# EAGLE design akcel_onlyboard (EAGLE 7.7.0)
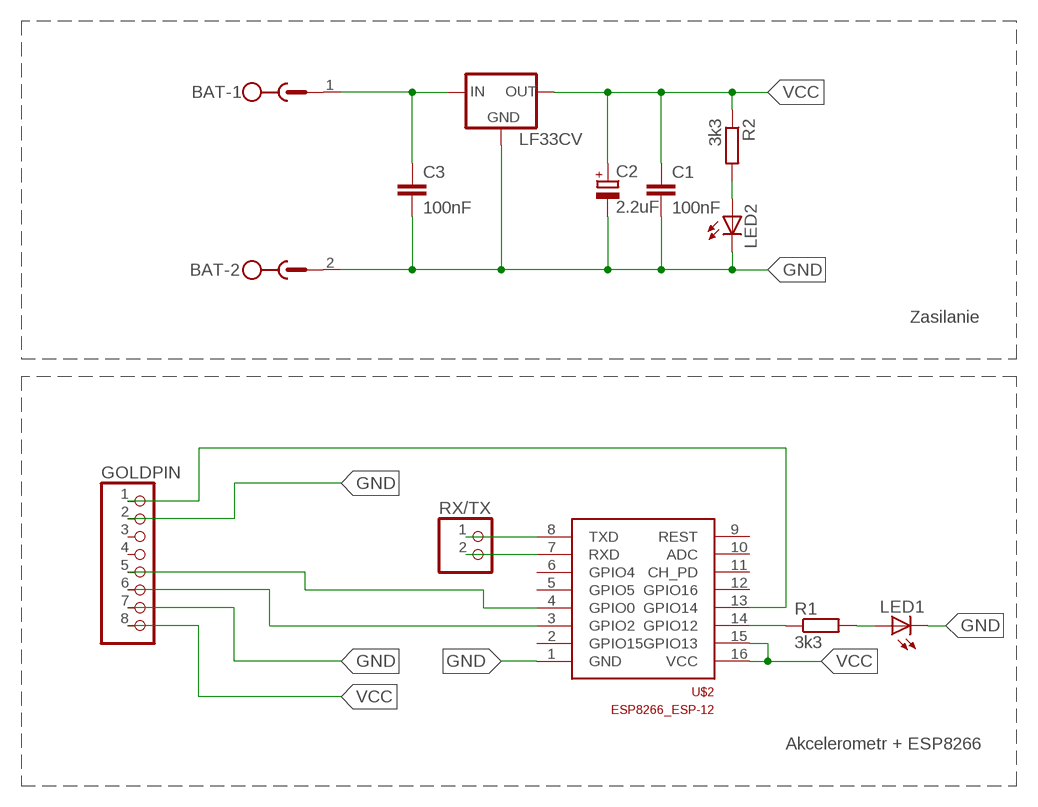
[diagram p0: schematic, sheet 1]

## Parts
BAT  MSTBV2  [MSTBV2]
C1  100nF  C-EUC0805K  [C0805K]
C2  2.2uF  CPOL-EU153CLV-0405  [153CLV-0405]
C3  100nF  C-EUC0805K  [C0805K]
GOLDPIN  PINHD-1X8  [1X08]
LED1  LED3MM  [LED3MM]
LED2  LED3MM  [LED3MM]
LF33CV  LM1117TO252  [TO252]
R1  3k3  R-EU_M0805  [M0805]
R2  3k3  R-EU_M0805  [M0805]
RX/TX  PINHD-1X2  [1X02]
U$2  ESP8266_ESP-12  [ESP8266-ESP12]

## Nets
GND: BAT.2 C1.2 C2.- C3.2 GOLDPIN.2 GOLDPIN.7 LED1.K(C) LED2.K(C) LF33CV.3(GND) U$2.1(GND)
N$1: GOLDPIN.6 U$2.3(GPIO2)
N$2: GOLDPIN.5 U$2.4(GPIO0)
N$4: GOLDPIN.1 U$2.13(GPIO14)
N$5: RX/TX.1 U$2.8(TXD)
N$6: RX/TX.2 U$2.7(RXD)
N$7: R1.1 U$2.14(GPIO12)
N$8: LED1.A R1.2
N$9: BAT.1 C3.1 LF33CV.1(IN)
N$11: LED2.A R2.2
VCC: C1.1 C2.+ GOLDPIN.8 LF33CV.2(OUT) R2.1 U$2.15(GPIO13) U$2.16(VCC)
Unconnected: GOLDPIN.3 GOLDPIN.4 U$2.2(GPIO15) U$2.5(GPIO5) U$2.6(GPIO4) U$2.9(REST) U$2.10(ADC) U$2.11(CH_PD) U$2.12(GPIO16)

## Notes on the sheet
- Zasilanie
- Akcelerometr + ESP8266

## Library data of the parts
BAT = con-phoenix-500:MSTBV2: PHOENIX; OC_FARNELL: unknown; OC_NEWARK: unknown
C1 C3 = rcl:C-EU: CAPACITOR, European symbol
C2 = rcl:CPOL-EU: POLARIZED CAPACITOR, European symbol
GOLDPIN = pinhead:PINHD-1X8: PIN HEADER
LED1 LED2 = led:LED: LED OSRAM: - CHIPLED LG R971, LG N971, LY N971, LG Q971, LY Q971, LO R971, LY R971 LH N974, LH R974 LS Q976, LO Q976, LY Q976 LO Q996 - Hyper CHIPLED LW Q18S LB Q993, LB Q99A, LB R99A - SideLED LS A670, LO A670, LY A670, LG A670, LP A670 LB A673, LV A673, LT A673, LW A673 LH A674 LY A675 LS A676, LA A676, LO A676, LY A676, LW A676 LS A679, LY A679, LG A679 - Hyper Micro SIDELED® LS Y876, LA Y876, LO Y876, LY Y876 LT Y87S - SmartLED LW L88C, LW L88S LB L89C, LB L89S, LG L890 LS L89K, LO L89K, LY L89K LS L896, LA L896, LO L896, LY L896 - TOPLED LS T670, LO T670, LY T670, LG T670, LP T670 LSG T670, LSP T670, LSY T670, LOP T670, LYG T670 LG T671, LOG T671, LSG T671 LB T673, LV T673, LT T673, LW T673 LH T674 LS T676, LA T676, LO T676, LY T676, LB T676, LH T676, LSB T676, LW T676 LB T67C, LV T67C, LT T67C, LS T67K, LO T67K, LY T67K, LW E67C LS E67B, LA E67B, LO E67B, LY E67B, LB E67C, LV E67C, LT E67C LW T67C LS T679, LY T679, LG T679 LS T770, LO T770, LY T770, LG T770, LP T770 LB T773, LV T773, LT T773, LW T773 LH T774 LS E675, LA E675, LY E675, LS T675 LS T776, LA T776, LO T776, LY T776, LB T776 LHGB T686 LT T68C, LB T68C - Hyper Mini TOPLED® LB M676 - Mini TOPLED Santana® LG M470 LS M47K, LO M47K, LY M47K Source: http://www.osram.convergy.de LUXEON: - LUMILED® LXK2-PW12-R00, LXK2-PW12-S00, LXK2-PW14-U00, LXK2-PW14-V00 LXK2-PM12-R00, LXK2-PM12-S00, LXK2-PM14-U00 LXK2-PE12-Q00, LXK2-PE12-R00, LXK2-PE12-S00, LXK2-PE14-T00, LXK2-PE14-U00 LXK2-PB12-K00, LXK2-PB12-L00, LXK2-PB12-M00, LXK2-PB14-N00, LXK2-PB14-P00, LXK2-PB14-Q00 LXK2-PR12-L00, LXK2-PR12-M00, LXK2-PR14-Q00, LXK2-PR14-R00 LXK2-PD12-Q00, LXK2-PD12-R00, LXK2-PD12-S00 LXK2-PH12-R00, LXK2-PH12-S00 LXK2-PL12-P00, LXK2-PL12-Q00, LXK2-PL12-R00 Source: www.luxeon.com KINGBRIGHT: KA-3528ASYC Source: www.kingbright.com
LF33CV = v-reg-3:LM1117
R1 R2 = rcl:R-EU_: RESISTOR, European symbol
RX/TX = pinhead:PINHD-1X2: PIN HEADER
U$2 = esp8266-12:ESP8266_ESP-12

## Board
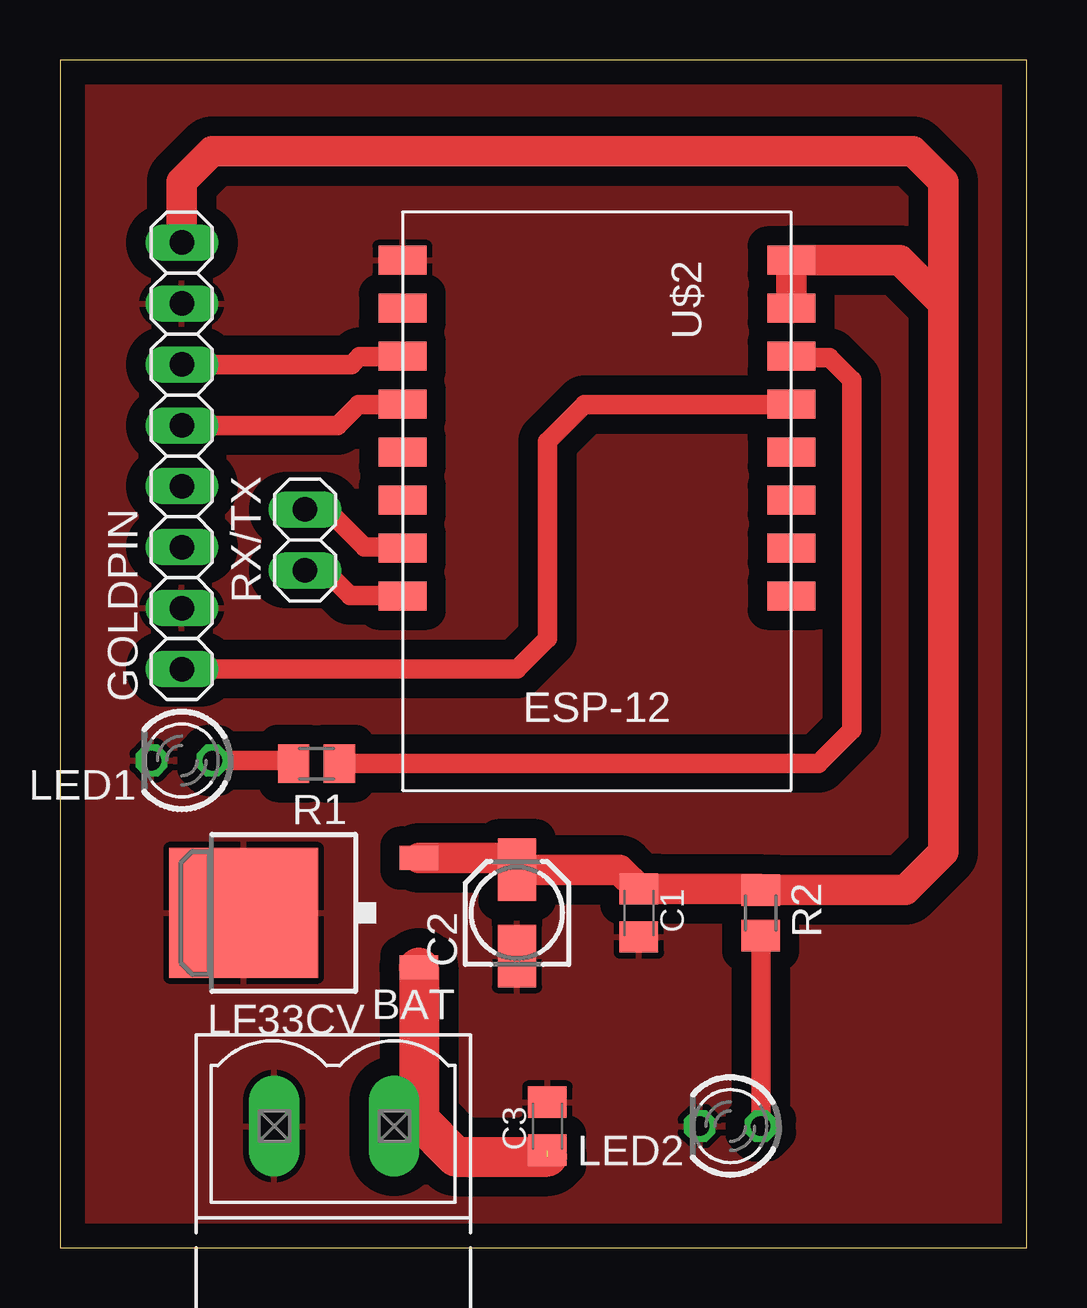
[diagram p1: board, top side]

Size 40.31 x 49.52 mm. Coordinates in mm from the lower left corner, seen from the top.
Outline: 0,0 40.31,0 40.31,49.52 0,49.52 0,0
Copper layers (1*16): Top 0.035mm / dielectric 1.5mm / Bottom 0.035mm
Design rules "default": minimum track width 10mil, minimum drill 24mil, track to track 8mil, track to pad 8mil, pad to pad 8mil, via to via 8mil, smd to smd 8mil, copper to edge 40mil, drill to drill 8mil, minimum pad ring 10mil, minimum via ring 8mil, stop-mask expansion 4mil, vias tented up to drill 0mil, thermal gap 10mil

### Footprints (pad centres in the part's own frame; a part is rotated, then mirrored left to right if it is on the bottom)
MSTBV2 = drill 1.397 long: 1 -2.5,0; 2 2.5,0
C0805K = smd 1.3 x 1.6: 1 -1,0; 2 1,0
153CLV-0405 = smd 2.6 x 1.6: + 1.8,0; - -1.8,0
1X08 = drill 1.016 long: 1 -8.89,0; 2 -6.35,0; 3 -3.81,0; 4 -1.27,0; 5 1.27,0; 6 3.81,0; 7 6.35,0; 8 8.89,0
LED3MM = drill 0.813 octagon: A -1.27,0; K 1.27,0
TO252 = smd 1 x 1.6: 1 -2.28,-6.07; 2 2.28,-6.07 | smd 5.4 x 6.2: 3 0,1.23
M0805 = smd 1.3 x 1.6: 1 -0.95,0; 2 0.95,0
1X02 = drill 1.016 long: 1 -1.27,0; 2 1.27,0
ESP8266-ESP12 = smd 2 x 1.2: 1 16.2,2; 2 16.2,4; 3 16.2,6; 4 16.2,8; 5 16.2,10; 6 16.2,12; 7 16.2,14; 8 16.2,16; 9 0,16; 10 0,14; 11 0,12; 12 0,10; 13 0,8; 14 0,6; 15 0,4; 16 0,2

### Placement (x,y rotation side)
BAT  11.43,5.08 180 top
C1  24.13,13.97 270 top
C2  19.05,13.97 90 top
C3  20.32,5.08 90 top
GOLDPIN  5.08,33.02 90 top
LED1  5.08,20.32 180 top
LED2  27.94,5.08 180 top
LF33CV  8.89,13.97 90 top
R1  10.69,20.19 180 top
R2  29.21,13.97 270 top
RX/TX  10.21,29.51 90 top
U$2  30.48,43.18 180 top

### Tracks (layer width: path | path; a pad name or v marks a point on that pad's centre or on a via)
GND
  pour Top (isolate 0.813): 0,49.53 40.64,49.53 40.64,0 0,0
N$1
  Top 0.813: GOLDPIN.6 12.17,36.83 12.5,37.16 14.26,37.16 U$2.3
N$2
  Top 0.813: GOLDPIN.5 11.58,34.29 12.45,35.15 14.25,35.15 U$2.4
N$4
  Top 0.813: U$2.13 30.45,35.15 21.87,35.15 20.32,33.6 20.32,25.4 19.05,24.13 GOLDPIN.1
N$5
  Top 0.813: 14.18,27.08 U$2.8 14.26,27.2 12.09,27.2 11.05,28.25 RX/TX.1
N$6
  Top 0.813: 14.26,29.16 U$2.7 14.25,29.21 12.7,29.21 11.12,30.79 RX/TX.2
N$7
  Top 0.813: R1.1 31.62,20.19 33.02,21.59 33.02,36.17 32.08,37.11 30.55,37.11 U$2.14
N$8
  Top 0.813: LED1.A 9.62,20.32 R1.2
N$9  (1 unrouted)
  Top 1.676: LF33CV.1 14.96,6.11 | 14.96,6.11 BAT.1 | 14.96,6.11 14.96,5.36 16.51,3.81 20.32,3.81
N$11
  Top 0.813: LED2.A R2.2
N$14
  Top 1.27: 7.62,15.24 6.35,15.24
VCC
  Top 1.27: LF33CV.2 18.57,16.25 C2.+ 23.33,15.77 C1.1 29.16,14.97 R2.1 35.24,14.92 36.83,16.51 36.83,39.37 | GOLDPIN.8 5.08,44.45 6.35,45.72 35.56,45.72 36.83,44.45 36.83,39.37 | U$2.15 U$2.16 35.02,41.18 36.83,39.37